# Altium schematic sheet main.SchDoc
size A4
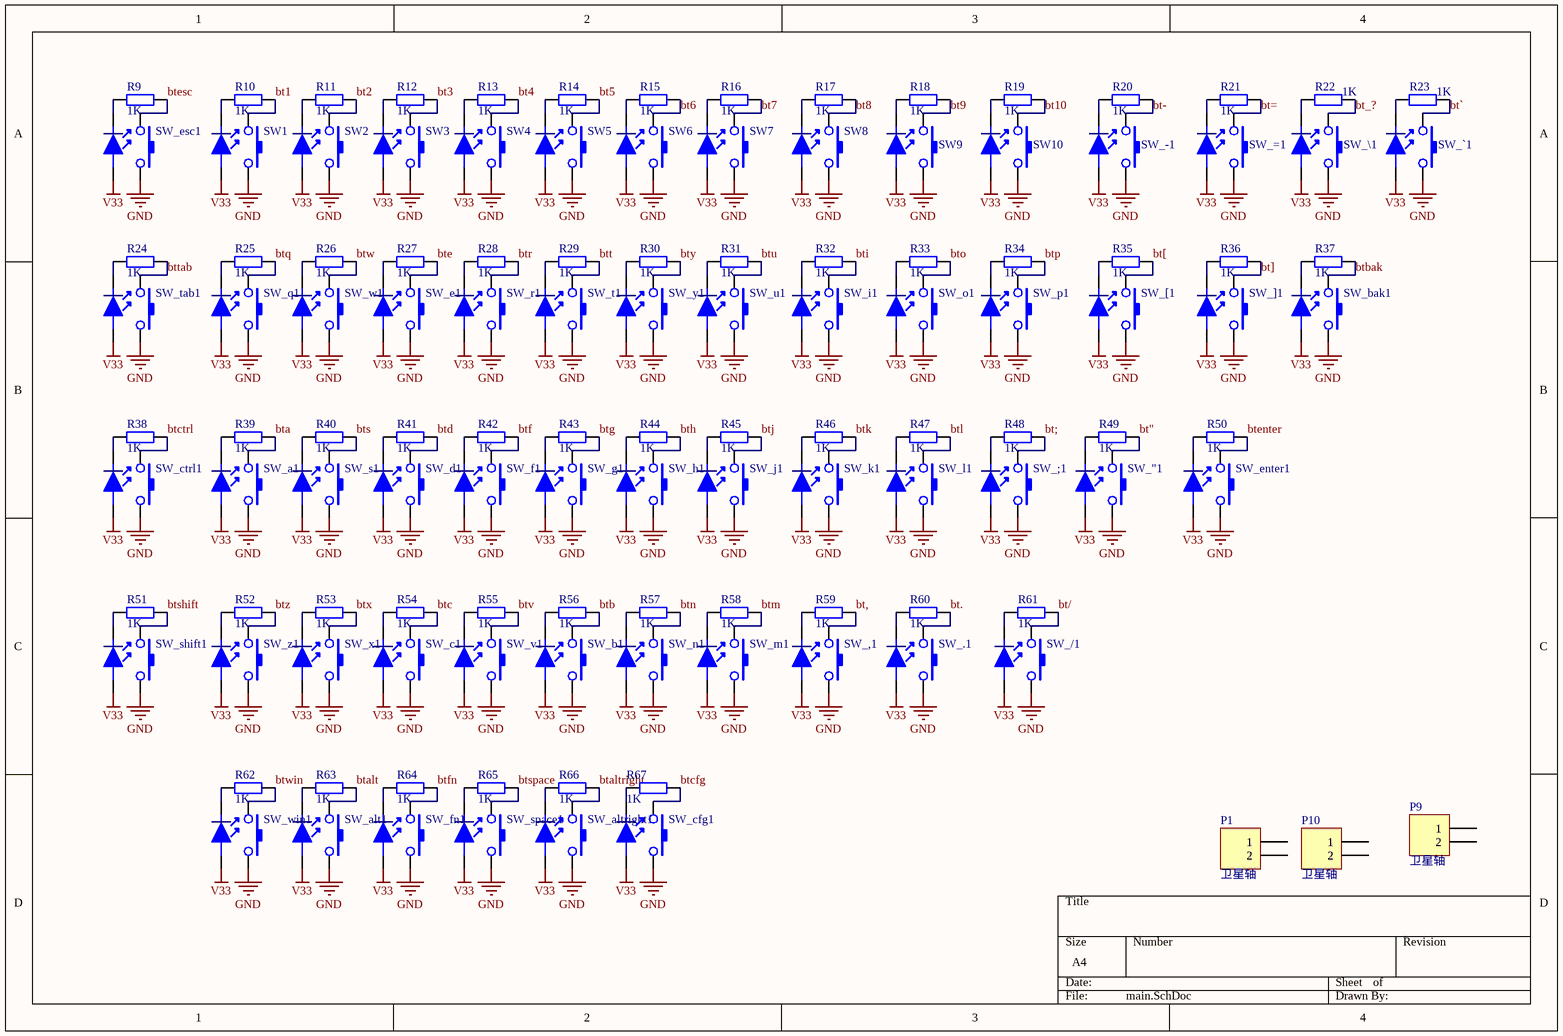
[diagram p0: main.SchDoc]

## Parts
P1  卫星轴  [1x3]
P9  卫星轴  [1x2]
P10  卫星轴  [1x2]
R9  value 1K  [RES0805(2012M)]  (hidden comment: Res2)
R10  value 1K  [RES0805(2012M)]  (hidden comment: Res2)
R11  value 1K  [RES0805(2012M)]  (hidden comment: Res2)
R12  value 1K  [RES0805(2012M)]  (hidden comment: Res2)
R13  value 1K  [RES0805(2012M)]  (hidden comment: Res2)
R14  value 1K  [RES0805(2012M)]  (hidden comment: Res2)
R15  value 1K  [RES0805(2012M)]  (hidden comment: Res2)
R16  value 1K  [RES0805(2012M)]  (hidden comment: Res2)
R17  value 1K  [RES0805(2012M)]  (hidden comment: Res2)
R18  value 1K  [RES0805(2012M)]  (hidden comment: Res2)
R19  value 1K  [RES0805(2012M)]  (hidden comment: Res2)
R20  value 1K  [RES0805(2012M)]  (hidden comment: Res2)
R21  value 1K  [RES0805(2012M)]  (hidden comment: Res2)
R22  value 1K  [RES0805(2012M)]  (hidden comment: Res2)
R23  value 1K  [RES0805(2012M)]  (hidden comment: Res2)
R24  value 1K  [RES0805(2012M)]  (hidden comment: Res2)
R25  value 1K  [RES0805(2012M)]  (hidden comment: Res2)
R26  value 1K  [RES0805(2012M)]  (hidden comment: Res2)
R27  value 1K  [RES0805(2012M)]  (hidden comment: Res2)
R28  value 1K  [RES0805(2012M)]  (hidden comment: Res2)
R29  value 1K  [RES0805(2012M)]  (hidden comment: Res2)
R30  value 1K  [RES0805(2012M)]  (hidden comment: Res2)
R31  value 1K  [RES0805(2012M)]  (hidden comment: Res2)
R32  value 1K  [RES0805(2012M)]  (hidden comment: Res2)
R33  value 1K  [RES0805(2012M)]  (hidden comment: Res2)
R34  value 1K  [RES0805(2012M)]  (hidden comment: Res2)
R35  value 1K  [RES0805(2012M)]  (hidden comment: Res2)
R36  value 1K  [RES0805(2012M)]  (hidden comment: Res2)
R37  value 1K  [RES0805(2012M)]  (hidden comment: Res2)
R38  value 1K  [RES0805(2012M)]  (hidden comment: Res2)
R39  value 1K  [RES0805(2012M)]  (hidden comment: Res2)
R40  value 1K  [RES0805(2012M)]  (hidden comment: Res2)
R41  value 1K  [RES0805(2012M)]  (hidden comment: Res2)
R42  value 1K  [RES0805(2012M)]  (hidden comment: Res2)
R43  value 1K  [RES0805(2012M)]  (hidden comment: Res2)
R44  value 1K  [RES0805(2012M)]  (hidden comment: Res2)
R45  value 1K  [RES0805(2012M)]  (hidden comment: Res2)
R46  value 1K  [RES0805(2012M)]  (hidden comment: Res2)
R47  value 1K  [RES0805(2012M)]  (hidden comment: Res2)
R48  value 1K  [RES0805(2012M)]  (hidden comment: Res2)
R49  value 1K  [RES0805(2012M)]  (hidden comment: Res2)
R50  value 1K  [RES0805(2012M)]  (hidden comment: Res2)
R51  value 1K  [RES0805(2012M)]  (hidden comment: Res2)
R52  value 1K  [RES0805(2012M)]  (hidden comment: Res2)
R53  value 1K  [RES0805(2012M)]  (hidden comment: Res2)
R54  value 1K  [RES0805(2012M)]  (hidden comment: Res2)
R55  value 1K  [RES0805(2012M)]  (hidden comment: Res2)
R56  value 1K  [RES0805(2012M)]  (hidden comment: Res2)
R57  value 1K  [RES0805(2012M)]  (hidden comment: Res2)
R58  value 1K  [RES0805(2012M)]  (hidden comment: Res2)
R59  value 1K  [RES0805(2012M)]  (hidden comment: Res2)
R60  value 1K  [RES0805(2012M)]  (hidden comment: Res2)
R61  value 1K  [RES0805(2012M)]  (hidden comment: Res2)
R62  value 1K  [RES0805(2012M)]  (hidden comment: Res2)
R63  value 1K  [RES0805(2012M)]  (hidden comment: Res2)
R64  value 1K  [RES0805(2012M)]  (hidden comment: Res2)
R65  value 1K  [RES0805(2012M)]  (hidden comment: Res2)
R66  value 1K  [RES0805(2012M)]  (hidden comment: Res2)
R67  value 1K  [RES0805(2012M)]  (hidden comment: Res2)
SW1  (no value)  [MX_SW-5]
SW2  (no value)  [MX_SW-5]
SW3  (no value)  [MX_SW-5]
SW4  (no value)  [MX_SW-5]
SW5  (no value)  [MX_SW-5]
SW6  (no value)  [MX_SW-5]
SW7  (no value)  [MX_SW-5]
SW8  (no value)  [MX_SW-5]
SW9  (no value)  [MX_SW-5]
SW10  (no value)  [MX_SW-5]
SW_"1  (no value)  [MX_SW-5]
SW_,1  (no value)  [MX_SW-5]
SW_-1  (no value)  [MX_SW-5]
SW_.1  (no value)  [MX_SW-5]
SW_/1  (no value)  [MX_SW-5]
SW_;1  (no value)  [MX_SW-5]
SW_=1  (no value)  [MX_SW-5]
SW_[1  (no value)  [MX_SW-5]
SW_\1  (no value)  [MX_SW-5]
SW_]1  (no value)  [MX_SW-5]
SW_`1  (no value)  [MX_SW-5]
SW_a1  (no value)  [MX_SW-5]
SW_alt1  (no value)  [MX_SW-5]
SW_altright1  (no value)  [MX_SW-5]
SW_b1  (no value)  [MX_SW-5]
SW_bak1  (no value)  [MX_SW-5]
SW_c1  (no value)  [MX_SW-5]
SW_cfg1  (no value)  [MX_SW-5]
SW_ctrl1  (no value)  [MX_SW-5]
SW_d1  (no value)  [MX_SW-5]
SW_e1  (no value)  [MX_SW-5]
SW_enter1  (no value)  [MX_SW-5]
SW_esc1  (no value)  [MX_SW-5]
SW_f1  (no value)  [MX_SW-5]
SW_fn1  (no value)  [MX_SW-5]
SW_g1  (no value)  [MX_SW-5]
SW_h1  (no value)  [MX_SW-5]
SW_i1  (no value)  [MX_SW-5]
SW_j1  (no value)  [MX_SW-5]
SW_k1  (no value)  [MX_SW-5]
SW_l1  (no value)  [MX_SW-5]
SW_m1  (no value)  [MX_SW-5]
SW_n1  (no value)  [MX_SW-5]
SW_o1  (no value)  [MX_SW-5]
SW_p1  (no value)  [MX_SW-5]
SW_q1  (no value)  [MX_SW-5]
SW_r1  (no value)  [MX_SW-5]
SW_s1  (no value)  [MX_SW-5]
SW_shift1  (no value)  [MX_SW-5]
SW_space1  (no value)  [MX_SW-5]
SW_t1  (no value)  [MX_SW-5]
SW_tab1  (no value)  [MX_SW-5]
SW_u1  (no value)  [MX_SW-5]
SW_v1  (no value)  [MX_SW-5]
SW_w1  (no value)  [MX_SW-5]
SW_win1  (no value)  [MX_SW-5]
SW_x1  (no value)  [MX_SW-5]
SW_y1  (no value)  [MX_SW-5]
SW_z1  (no value)  [MX_SW-5]

## Nets
GND: SW1.1 SW2.1 SW3.1 SW4.1 SW5.1 SW6.1 SW7.1 SW8.1 SW9.1 SW10.1 SW_"1.1 SW_,1.1 SW_-1.1 SW_.1.1 SW_/1.1 SW_;1.1 SW_=1.1 SW_[1.1 SW_\1.1 SW_]1.1 SW_`1.1 SW_a1.1 SW_alt1.1 SW_altright1.1 SW_b1.1 SW_bak1.1 SW_c1.1 SW_cfg1.1 SW_ctrl1.1 SW_d1.1 SW_e1.1 SW_enter1.1 SW_esc1.1 SW_f1.1 SW_fn1.1 SW_g1.1 SW_h1.1 SW_i1.1 SW_j1.1 SW_k1.1 SW_l1.1 SW_m1.1 SW_n1.1 SW_o1.1 SW_p1.1 SW_q1.1 SW_r1.1 SW_s1.1 SW_shift1.1 SW_space1.1 SW_t1.1 SW_tab1.1 SW_u1.1 SW_v1.1 SW_w1.1 SW_win1.1 SW_x1.1 SW_y1.1 SW_z1.1
V33: SW1.3 SW2.3 SW3.3 SW4.3 SW5.3 SW6.3 SW7.3 SW8.3 SW9.3 SW10.3 SW_"1.3 SW_,1.3 SW_-1.3 SW_.1.3 SW_/1.3 SW_;1.3 SW_=1.3 SW_[1.3 SW_\1.3 SW_]1.3 SW_`1.3 SW_a1.3 SW_alt1.3 SW_altright1.3 SW_b1.3 SW_bak1.3 SW_c1.3 SW_cfg1.3 SW_ctrl1.3 SW_d1.3 SW_e1.3 SW_enter1.3 SW_esc1.3 SW_f1.3 SW_fn1.3 SW_g1.3 SW_h1.3 SW_i1.3 SW_j1.3 SW_k1.3 SW_l1.3 SW_m1.3 SW_n1.3 SW_o1.3 SW_p1.3 SW_q1.3 SW_r1.3 SW_s1.3 SW_shift1.3 SW_space1.3 SW_t1.3 SW_tab1.3 SW_u1.3 SW_v1.3 SW_w1.3 SW_win1.3 SW_x1.3 SW_y1.3 SW_z1.3
bt1: R10.2 SW1.2
bt2: R11.2 SW2.2
bt3: R12.2 SW3.2
bt4: R13.2 SW4.2
bt5: R14.2 SW5.2
bt6: R15.2 SW6.2
bt7: R16.2 SW7.2
bt8: R17.2 SW8.2
bt9: R18.2 SW9.2
bt10: R19.2 SW10.2
bt": R49.2 SW_"1.2
bt,: R59.2 SW_,1.2
bt-: R20.2 SW_-1.2
bt.: R60.2 SW_.1.2
bt/: R61.2 SW_/1.2
bt;: R48.2 SW_;1.2
bt=: R21.2 SW_=1.2
bt[: R35.2 SW_[1.2
bt]: R36.2 SW_]1.2
bt_?: R22.2 SW_\1.2
bt`: R23.1 SW_`1.2
bta: R39.2 SW_a1.2
btalt: R63.2 SW_alt1.2
btaltright: R66.2 SW_altright1.2
btb: R56.2 SW_b1.2
btbak: R37.2 SW_bak1.2
btc: R54.2 SW_c1.2
btcfg: R67.2 SW_cfg1.2
btctrl: R38.2 SW_ctrl1.2
btd: R41.2 SW_d1.2
bte: R27.2 SW_e1.2
btenter: R50.2 SW_enter1.2
btesc: R9.2 SW_esc1.2
btf: R42.2 SW_f1.2
btfn: R64.2 SW_fn1.2
btg: R43.2 SW_g1.2
bth: R44.2 SW_h1.2
bti: R32.2 SW_i1.2
btj: R45.2 SW_j1.2
btk: R46.2 SW_k1.2
btl: R47.2 SW_l1.2
btm: R58.2 SW_m1.2
btn: R57.2 SW_n1.2
bto: R33.2 SW_o1.2
btp: R34.2 SW_p1.2
btq: R25.2 SW_q1.2
btr: R28.2 SW_r1.2
bts: R40.2 SW_s1.2
btshift: R51.2 SW_shift1.2
btspace: R65.2 SW_space1.2
btt: R29.2 SW_t1.2
bttab: R24.2 SW_tab1.2
btu: R31.2 SW_u1.2
btv: R55.2 SW_v1.2
btw: R26.2 SW_w1.2
btwin: R62.2 SW_win1.2
btx: R53.2 SW_x1.2
bty: R30.2 SW_y1.2
btz: R52.2 SW_z1.2
NetR9_1: R9.1 SW_esc1.4
NetR10_1: R10.1 SW1.4
NetR11_1: R11.1 SW2.4
NetR12_1: R12.1 SW3.4
NetR13_1: R13.1 SW4.4
NetR14_1: R14.1 SW5.4
NetR15_1: R15.1 SW6.4
NetR16_1: R16.1 SW7.4
NetR17_1: R17.1 SW8.4
NetR18_1: R18.1 SW9.4
NetR19_1: R19.1 SW10.4
NetR20_1: R20.1 SW_-1.4
NetR21_1: R21.1 SW_=1.4
NetR22_1: R22.1 SW_\1.4
NetR23_2: R23.2 SW_`1.4
NetR24_1: R24.1 SW_tab1.4
NetR25_1: R25.1 SW_q1.4
NetR26_1: R26.1 SW_w1.4
NetR27_1: R27.1 SW_e1.4
NetR28_1: R28.1 SW_r1.4
NetR29_1: R29.1 SW_t1.4
NetR30_1: R30.1 SW_y1.4
NetR31_1: R31.1 SW_u1.4
NetR32_1: R32.1 SW_i1.4
NetR33_1: R33.1 SW_o1.4
NetR34_1: R34.1 SW_p1.4
NetR35_1: R35.1 SW_[1.4
NetR36_1: R36.1 SW_]1.4
NetR37_1: R37.1 SW_bak1.4
NetR38_1: R38.1 SW_ctrl1.4
NetR39_1: R39.1 SW_a1.4
NetR40_1: R40.1 SW_s1.4
NetR41_1: R41.1 SW_d1.4
NetR42_1: R42.1 SW_f1.4
NetR43_1: R43.1 SW_g1.4
NetR44_1: R44.1 SW_h1.4
NetR45_1: R45.1 SW_j1.4
NetR46_1: R46.1 SW_k1.4
NetR47_1: R47.1 SW_l1.4
NetR48_1: R48.1 SW_;1.4
NetR49_1: R49.1 SW_"1.4
NetR50_1: R50.1 SW_enter1.4
NetR51_1: R51.1 SW_shift1.4
NetR52_1: R52.1 SW_z1.4
NetR53_1: R53.1 SW_x1.4
NetR54_1: R54.1 SW_c1.4
NetR55_1: R55.1 SW_v1.4
NetR56_1: R56.1 SW_b1.4
NetR57_1: R57.1 SW_n1.4
NetR58_1: R58.1 SW_m1.4
NetR59_1: R59.1 SW_,1.4
NetR60_1: R60.1 SW_.1.4
NetR61_1: R61.1 SW_/1.4
NetR62_1: R62.1 SW_win1.4
NetR63_1: R63.1 SW_alt1.4
NetR64_1: R64.1 SW_fn1.4
NetR65_1: R65.1 SW_space1.4
NetR66_1: R66.1 SW_altright1.4
NetR67_1: R67.1 SW_cfg1.4

Not connected (* = marked no-connect by the designer): P1 1 2; P9 1 2; P10 1 2

## Library data of the parts
P1 P9 P10 = Header 2: Header, 2-Pin; LatestRevisionDate: 17-Jul-2002; LatestRevisionNote: Re-released for DXP Platform.; Publisher: Altium Limited
R9-R67 = Res2: Resistor; Published: 8-Jun-2000; LatestRevisionDate: 17-Jul-2002; LatestRevisionNote: Re-released for DXP Platform.; PackageReference: AXIAL-0.4; Publisher: Altium Limited; PackageDescription: Axial Device, Thru-Hole; 2 Leads; 0.4 in Pin Spacing
SW1-SW10 SW_"1 SW_,1 SW_-1 SW_.1 SW_/1 SW_;1 SW_=1 SW_[1 SW_\1 SW_]1 SW_`1 SW_a1 SW_alt1 SW_altright1 SW_b1 SW_bak1 SW_c1 SW_cfg1 SW_ctrl1 SW_d1 SW_e1 SW_enter1 SW_esc1 SW_f1 SW_fn1 SW_g1 SW_h1 SW_i1 SW_j1 SW_k1 SW_l1 SW_m1 SW_n1 SW_o1 SW_p1 SW_q1 SW_r1 SW_s1 SW_shift1 SW_space1 SW_t1 SW_tab1 SW_u1 SW_v1 SW_w1 SW_win1 SW_x1 SW_y1 SW_z1 = MX_SW-5: with Fixation pins  1-Pole w/LED